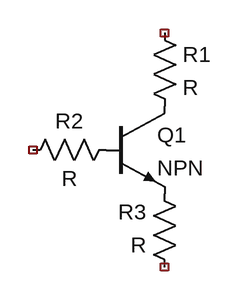
[diagram p0: schematic Draft9.asc]
Draft9.asc, the LTspice schematic file:
Version 4
SHEET 1 880 680
SYMBOL npn 128 96 R0
SYMATTR InstName Q1
SYMBOL res 176 0 R0
SYMATTR InstName R1
SYMBOL res 144 128 R90
WINDOW 0 0 56 VBottom 2
WINDOW 3 32 56 VTop 2
SYMATTR InstName R2
SYMBOL res 208 288 R180
WINDOW 0 36 76 Left 2
WINDOW 3 36 40 Left 2
SYMATTR InstName R3

The netlist it stands for:
* Draft9.asc
Q1 P001 P002 P003 0 NPN
R1 NC_01 P001 R
R2 P002 NC_02 R
R3 NC_03 P003 R
.model NPN NPN
.model PNP PNP
.lib standard.bjt
.backanno
.end